# EAGLE design JSDM ESP32 DevKit DS3231 HUB12 & 08 Single Layer (EAGLE 7.7.0)
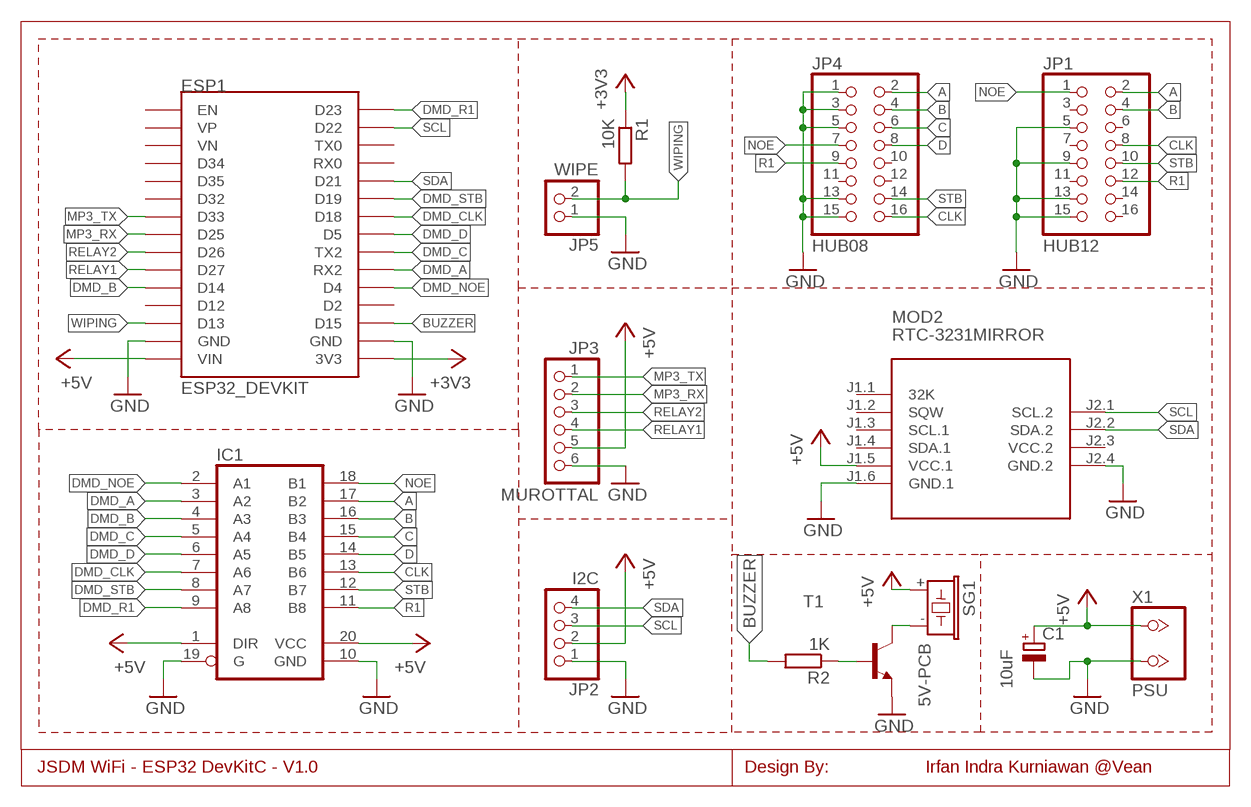
[diagram p0: schematic, sheet 1]

## Parts
C1  10uF  CPOL-EUE3.5-8  [E3,5-8]
ESP1  ESP32_DEVKIT  [ESP32_DEVKIT]
IC1  74245SMD  [SO20]
JP1  HUB12  PINHD-2X8  [2X08]
JP2  I2C  PINHD-1X4  [1X04]
JP3  MUROTTAL  PINHD-1X6  [1X06]
JP4  HUB08  PINHD-2X8  [2X08]
JP5  WIPE  PINHD-1X2  [1X02]
MOD2  RTC-3231MIRROR  [RTC-DS3231-MIRROR]
R1  10K  R-EU_0207/7  [0207/7]
R2  1K  R-EU_0207/10  [0207/10]
SG1  5V-PCB  [5V]
T1  BC317-NPN-TO92-EBC  [TO92-EBC]
X1  PSU  2PIN  [TB2]

## Nets
+3V3: ESP1.3V3 R1.1
+5V: C1.+ ESP1.VIN IC1.1(DIR) IC1.20(VCC) JP2.2 JP3.5 MOD2.J1.5(VCC.1) SG1.+ X1.1
A: IC1.17(B2) JP1.2 JP4.2
B: IC1.16(B3) JP1.4 JP4.4
BUZZER: ESP1.D15 R2.2
C: IC1.15(B4) JP4.6
CLK: IC1.13(B6) JP1.8 JP4.16
D: IC1.14(B5) JP4.8
DMD_A: ESP1.RX2 IC1.3(A2)
DMD_B: ESP1.D14 IC1.4(A3)
DMD_C: ESP1.TX2 IC1.5(A4)
DMD_CLK: ESP1.D18 IC1.7(A6)
DMD_D: ESP1.D5 IC1.6(A5)
DMD_NOE: ESP1.D4 IC1.2(A1)
DMD_R1: ESP1.D23 IC1.9(A8)
DMD_STB: ESP1.D19 IC1.8(A7)
GND: C1.- ESP1.GND@1(GND) ESP1.GND@2(GND) IC1.10(GND) IC1.19(G) JP1.5 JP1.9 JP1.13 JP1.15 JP2.1 JP3.6 JP4.1 JP4.3 JP4.5 JP4.13 JP4.15 JP5.1 MOD2.J1.6(GND.1) MOD2.J2.4(GND.2) T1.E X1.2
MP3_RX: ESP1.D25 JP3.2
MP3_TX: ESP1.D33 JP3.1
N$2: SG1.- T1.C
N$3: R2.1 T1.B
NOE: IC1.18(B1) JP1.1 JP4.7
R1: IC1.11(B8) JP1.12 JP4.9
RELAY1: ESP1.D27 JP3.4
RELAY2: ESP1.D26 JP3.3
SCL: ESP1.D22 JP2.3 MOD2.J2.1(SCL.2)
SDA: ESP1.D21 JP2.4 MOD2.J2.2(SDA.2)
STB: IC1.12(B7) JP1.10 JP4.14
WIPING: ESP1.D13 JP5.2 R1.2
Unconnected: ESP1.D2 ESP1.D12 ESP1.D32 ESP1.D34 ESP1.D35 ESP1.EN ESP1.RX0 ESP1.TX0 ESP1.VN ESP1.VP JP1.3 JP1.6 JP1.7 JP1.11 JP1.14 JP1.16 JP4.10 JP4.11 JP4.12 MOD2.J1.1(32K) MOD2.J1.2(SQW) MOD2.J1.3(SCL.1) MOD2.J1.4(SDA.1)

## Notes on the sheet
- JSDM WiFi - ESP32 DevKitC - V1.0 | Design By: | Irfan Indra Kurniawan @Vean

## Power pins joined to a net without a drawn wire
VCC.2: MOD2.J2.3(VCC.2)

## Library data of the parts
C1 = FansElectronics-RCL:CPOL-EU: POLARIZED CAPACITOR, European symbol
ESP1 = DOIT_ESP32_DEVKIT:ESP32_DEVKIT: ESP32 DEVKIT BOARD
IC1 = FansElectronics-IC-74xx:74*245
JP1 JP4 = FansElectronics-Header:PINHD-2X8: PIN HEADER
JP2 = FansElectronics-Header:PINHD-1X4: PIN HEADER
JP3 = FansElectronics-Header:PINHD-1X6: PIN HEADER
JP5 = FansElectronics-Header:PINHD-1X2: PIN HEADER
MOD2 = FansElectronics-Modul:RTC-3231
R1 R2 = FansElectronics-RCL:R-EU_: RESISTOR, European symbol
SG1 = FansElectronics-Buzzer:5V-PCB: Buzzer 5V on PCB
T1 = transistor:*-NPN-: NPN Transistror BF959 corrected 2008.03.06
X1 = FansElectronics-Con-Screw:2PIN

## Board
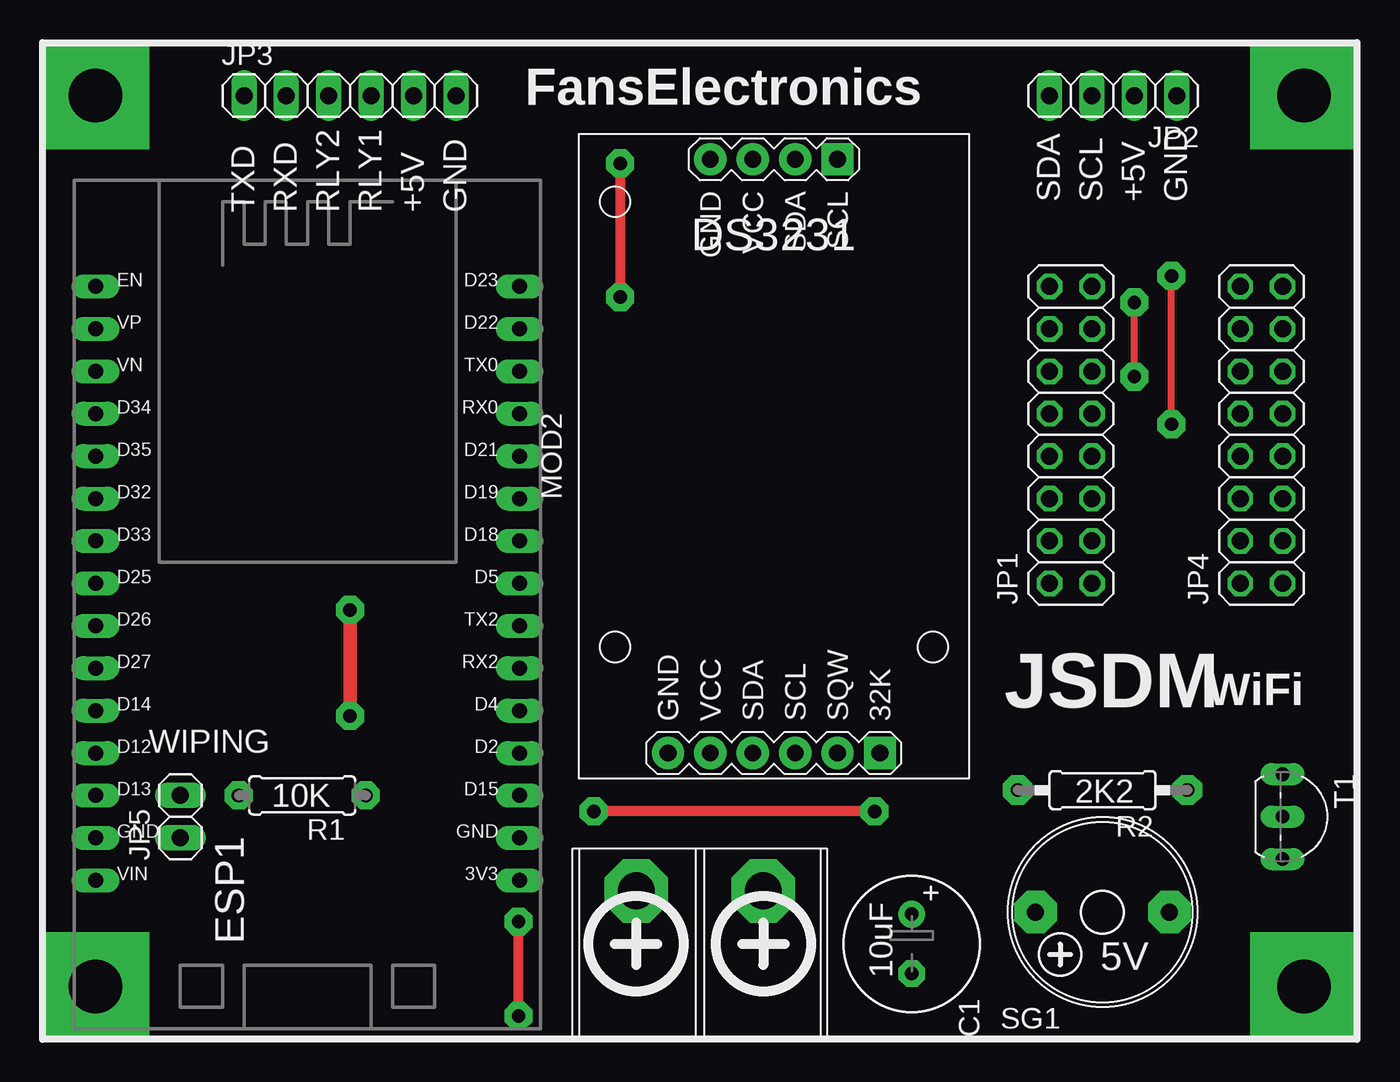
[diagram p1: board, top side]
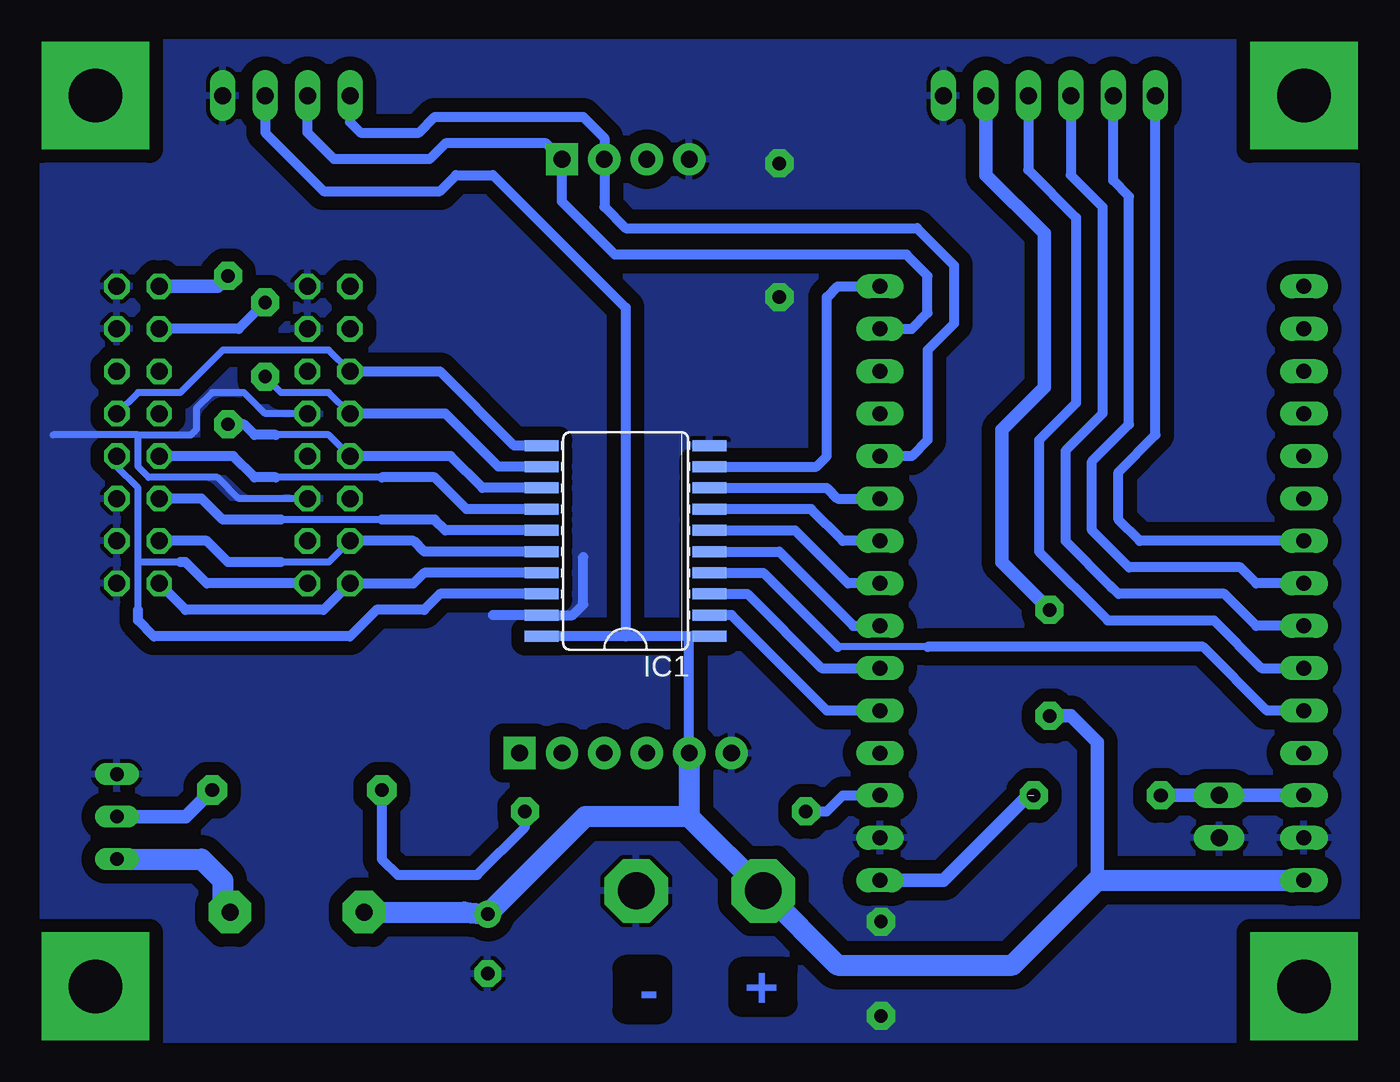
[diagram p2: board, bottom side, seen from below]

No outline drawn. Coordinates in mm, seen from the top.
Copper layers (1*16): Top 0.035mm / dielectric 1.5mm / Bottom 0.035mm
Design rules "default": minimum track width 10mil, minimum drill 24mil, track to track 8mil, track to pad 8mil, pad to pad 8mil, via to via 8mil, smd to smd 8mil, copper to edge 40mil, drill to drill 8mil, minimum pad ring 10mil, minimum via ring 8mil, stop-mask expansion 4mil, vias tented up to drill 0mil, thermal gap 10mil

### Footprints (pad centres in the part's own frame; a part is rotated, then mirrored left to right if it is on the bottom)
E3,5-8 = drill 0.813 pad 1.6: + -1.778,0 | drill 0.813 pad 1.6 octagon: - 1.778,0
ESP32_DEVKIT = drill 0.9 pad 1.422 long: 3V3 11.43,-17.78; D2 11.43,-10.16; D4 11.43,-7.62; D5 11.43,0; D12 -13.97,-10.16; D13 -13.97,-12.7; D14 -13.97,-7.62; D15 11.43,-12.7; D18 11.43,2.54; D19 11.43,5.08; D21 11.43,7.62; D22 11.43,15.24; D23 11.43,17.78; D25 -13.97,0; D26 -13.97,-2.54; D27 -13.97,-5.08; D32 -13.97,5.08; D33 -13.97,2.54; D34 -13.97,10.16; D35 -13.97,7.62; EN -13.97,17.78; GND@1 -13.97,-15.24; GND@2 11.43,-15.24; RX0 11.43,10.16; RX2 11.43,-5.08; TX0 11.43,12.7; TX2 11.43,-2.54; VIN -13.97,-17.78; VN -13.97,12.7; VP -13.97,15.24
SO20 = smd 0.66 x 2.032: 1 -5.715,-5.029; 2 -4.445,-5.029; 3 -3.175,-5.029; 4 -1.905,-5.029; 5 -0.635,-5.029; 6 0.635,-5.029; 7 1.905,-5.029; 8 3.175,-5.029; 9 4.445,-5.029; 10 5.715,-5.029; 11 5.715,5.029; 12 4.445,5.029; 13 3.175,5.029; 14 1.905,5.029; 15 0.635,5.029; 16 -0.635,5.029; 17 -1.905,5.029; 18 -3.175,5.029; 19 -4.445,5.029; 20 -5.715,5.029
2X08 = drill 1.016 octagon: 1 -8.89,-1.27; 2 -8.89,1.27; 3 -6.35,-1.27; 4 -6.35,1.27; 5 -3.81,-1.27; 6 -3.81,1.27; 7 -1.27,-1.27; 8 -1.27,1.27; 9 1.27,-1.27; 10 1.27,1.27; 11 3.81,-1.27; 12 3.81,1.27; 13 6.35,-1.27; 14 6.35,1.27; 15 8.89,-1.27; 16 8.89,1.27
1X04 = drill 1.016 long: 1 -3.81,0; 2 -1.27,0; 3 1.27,0; 4 3.81,0
1X06 = drill 1.016 long: 1 -6.35,0; 2 -3.81,0; 3 -1.27,0; 4 1.27,0; 5 3.81,0; 6 6.35,0
1X02 = drill 1.016 long: 1 -1.27,0; 2 1.27,0
RTC-DS3231-MIRROR = drill 1 pad 1.93 square: J1.1 -17.78,-6.35; J2.1 17.78,-3.81 | drill 1 pad 1.93: J1.2 -17.78,-3.81; J1.3 -17.78,-1.27; J1.4 -17.78,1.27; J1.5 -17.78,3.81; J1.6 -17.78,6.35; J2.2 17.78,-1.27; J2.3 17.78,1.27; J2.4 17.78,3.81
0207/7 = drill 0.813 pad 1.676 octagon: 1 -3.81,0; 2 3.81,0
0207/10 = drill 0.813 pad 1.778 octagon: 1 -5.08,0; 2 5.08,0
5V = drill 1.016 pad 2.54 octagon: + 4.01,0; - -4.01,0
TO92-EBC = drill 0.813 long: B 0,-1.27; C 2.54,-1.27; E -2.54,-1.27
TB2 = drill 2.2 pad 3.81 octagon: 1 -3.81,0; 2 3.81,0

### Placement (x,y rotation side)
C1  79.38,27.94 270 top
ESP1  44.45,49.53 0 top
IC1  71.12,52.07 90 bottom
JP1  88.9,58.42 90 top
JP2  91.44,78.74 180 top
JP3  45.72,78.74 0 top
JP4  100.33,58.42 90 top
JP5  35.56,35.56 90 top
MOD2  71.12,57.15 90 top
R1  42.86,36.83 180 top
R2  90.81,37.15 180 top
SG1  90.81,29.84 180 top
T1  102.87,35.56 270 top
X1  66.67,31.11 0 top

### Tracks (layer width: path | path; a pad name or v marks a point on that pad's centre or on a via)
+3V3  (1 unrouted)
  Bottom 0.813: ESP1.3V3 52.07,31.75 46.99,36.83
+5V  (via drill 0.8 pad 1.68)
  Top 0.813: v45.72,47.94 v45.72,41.59
  Bottom 0.61: MOD2.J1.5 67.31,46.35 IC1.1 71.12,46.35 | 71.12,46.35 IC1.20 | JP2.2 92.71,76.52 89.22,73.03 82.23,73.03 81.28,73.98 79.06,73.98 71.12,66.04 71.12,46.35
  Bottom 0.813: JP3.5 49.53,73.98 46.04,70.48 46.04,61.28 48.58,58.74 48.58,50.8 v45.72,47.94 | v45.72,41.59 44.45,41.59 42.86,40.01 42.86,31.75
  Bottom 1.27: ESP1.VIN 42.86,31.75 47.94,26.67 58.42,26.67 X1.1 67.31,35.56 | MOD2.J1.5 67.31,35.56 | 67.31,35.56 73.53,35.56 C1.+ 80.77,29.84 SG1.+
A
  Bottom 0.61: IC1.17 83.19,50.16 83.82,49.53 JP1.2 89.22,47.94 97.47,47.94 JP4.2
B
  Bottom 0.406: JP1.4 88.9,50.8 91.76,50.8
  Bottom 0.61: IC1.16 83.19,51.44 83.82,52.07 JP1.4 | 91.76,50.8 94.93,50.8 96.2,52.07 JP4.4
BUZZER  (via drill 0.8 pad 1.68)
  Top 0.61: v77.15,35.88 v60.33,35.88
  Bottom 0.61: R2.2 85.72,33.02 84.77,32.07 80.01,32.07 77.15,34.92 v77.15,35.88 | v60.33,35.88 59.05,35.88 58.1,36.83 ESP1.D15
C
  Bottom 0.406: 85.72,53.34 91.76,53.34
  Bottom 0.61: IC1.15 81.92,52.7 82.55,53.34 85.72,53.34 | 91.76,53.34 95.25,53.34 96.52,54.61 JP4.6
CLK  (via drill 0.8 pad 1.68)
  Top 0.406: v94.93,59.05 v94.93,67.94
  Bottom 0.406: JP1.8 88.9,58.42 92.08,58.42
  Bottom 0.61: IC1.13 79.69,55.24 81.6,57.15 JP1.8 | 92.08,58.42 93.34,58.42 93.98,59.05 v94.93,59.05
  Bottom 0.813: v94.93,67.94 95.57,67.31 JP4.16
D
  Bottom 0.406: 85.72,55.88 92.08,55.88
  Bottom 0.61: IC1.14 80.64,53.98 82.55,55.88 85.72,55.88 | 92.08,55.88 93.34,55.88 94.61,57.15 JP4.8
DMD_A
  Bottom 0.61: IC1.3 63.82,48.9 59.37,44.45 ESP1.RX2
DMD_B
  Bottom 0.406: 53.02,45.72 58.42,45.72
  Bottom 0.61: ESP1.D14 32.7,41.91 36.51,45.72 53.02,45.72 | IC1.4 62.87,50.16 58.42,45.72
DMD_C
  Bottom 0.61: IC1.5 61.91,51.44 57.47,46.99 ESP1.TX2
DMD_CLK
  Bottom 0.61: ESP1.D18 58.1,52.07 60.01,53.98 IC1.7
DMD_D
  Bottom 0.61: IC1.6 60.96,52.7 57.78,49.53 ESP1.D5
DMD_NOE
  Bottom 0.61: ESP1.D4 59.05,41.91 64.77,47.62 IC1.2
DMD_R1
  Bottom 0.61: IC1.9 59.69,56.52 59.05,57.15 59.05,66.67 58.42,67.31 ESP1.D23
DMD_STB
  Bottom 0.61: IC1.8 59.05,55.24 58.42,54.61 ESP1.D19
GND  (via drill 0.8 pad 1.68)
  Top 0.61: v55.82,23.62 v55.82,29.27 | v61.91,74.68 v61.91,66.67
  Bottom 0.406: JP1.5 94.3,54.61 95.57,55.88 99.69,55.88 100.33,56.52 100.33,58.42 | 100.33,58.42 105.41,58.42 | 100.33,58.42 97.16,58.42 96.84,58.74 96.84,60.01 95.89,60.96 93.98,60.96 92.71,59.69 JP1.9
  Bottom 0.61: 79.06,47.62 IC1.19 74.3,47.62 73.66,48.26 73.66,51.12
  pour Bottom (isolate 0.813): 27.3,81.92 106.05,81.92 106.05,22.23 27.3,22.23
MP3_RX
  Bottom 0.61: ESP1.D25 33.34,49.53 34.29,50.48 40.96,50.48 43.18,52.7 43.18,56.83 40.96,59.05 40.96,72.71 41.91,73.66 JP3.2
MP3_TX
  Bottom 0.61: ESP1.D33 40.32,52.07 41.59,53.34 41.59,56.2 39.37,58.42 JP3.1
N$1  (via drill 3.2 pad 6.45)
  other vias: 30.48,78.74
N$2
  Bottom 1.27: T1.C 96.52,33.02 95.25,31.75 95.25,30.28 SG1.-
N$3
  Bottom 0.813: T1.B 97.47,35.56 R2.1
N$4  (via drill 3.2 pad 6.45)
  other vias: 102.87,78.74
N$5  (via drill 3.2 pad 6.45)
  other vias: 102.87,25.4
N$6  (via drill 3.2 pad 6.45)
  other vias: 30.48,25.4
NOE
  Bottom 0.406: 100.33,47.94 100.33,50.8 | 97.79,50.8 100.33,50.8 | 100.33,50.8 100.33,55.24 101.6,56.52 JP4.7
  Bottom 0.61: IC1.18 82.23,48.9 83.19,47.94 86.04,47.94 87.63,46.35 99.38,46.35 100.33,47.31 100.33,47.94 | JP1.1 96.2,49.53 97.47,50.8 97.79,50.8
R1
  Bottom 0.406: JP1.12 88.9,63.5 95.25,63.5 97.79,60.96 100.33,60.96 JP4.9
  Bottom 0.61: IC1.11 77.79,57.78 82.23,62.23 JP1.12
RELAY1
  Bottom 0.61: JP3.4 46.99,74.3 44.13,71.44 44.13,60.33 46.35,58.1 46.35,51.44 42.23,47.31 35.88,47.31 33.02,44.45 ESP1.D27
RELAY2
  Bottom 0.61: JP3.3 44.45,73.98 42.55,72.07 42.55,59.69 44.77,57.47 44.77,52.07 42.07,49.37 41.91,49.21 41.59,48.9 35.24,48.9 33.34,46.99 ESP1.D26
SCL
  Bottom 0.61: ESP1.D22 53.98,64.77 53.02,65.72 53.02,67.94 54.29,69.22 71.75,69.22 74.93,72.39 MOD2.J2.1 75.88,75.88 81.92,75.88 82.87,74.93 88.58,74.93 90.17,76.52 JP2.3
SDA
  Bottom 0.61: ESP1.D21 53.98,57.15 53.02,58.1 53.02,63.5 51.44,65.09 51.44,68.58 53.66,70.8 71.12,70.8 72.39,72.07 MOD2.J2.2 72.39,76.2 73.66,77.47 82.55,77.47 83.5,76.52 87,76.52 87.63,77.15 JP2.4
STB  (via drill 0.8 pad 1.68)
  Top 0.406: v92.71,61.91 v92.71,66.36
  Bottom 0.406: JP1.10 88.9,60.96 91.76,60.96 v92.71,61.91
  Bottom 0.61: IC1.12 78.74,56.52 81.92,59.69 JP1.10 | v92.71,66.36 94.3,64.77 JP4.14
WIPING
  Bottom 0.813: R1.2 36.83,36.83 JP5.2 ESP1.D13

### Text on the board
Bottom: + | -
tPlace: FansElectronics | TXD | RXD | RLY2 | RLY1 | +5V | GND | SDA | SCL | +5V | GND | DS3231 | JSDM | WiFi | WIPING | 10K | 2K2 | 10uF | 5V